# Altium schematic sheet Scan.SchDoc
size A4
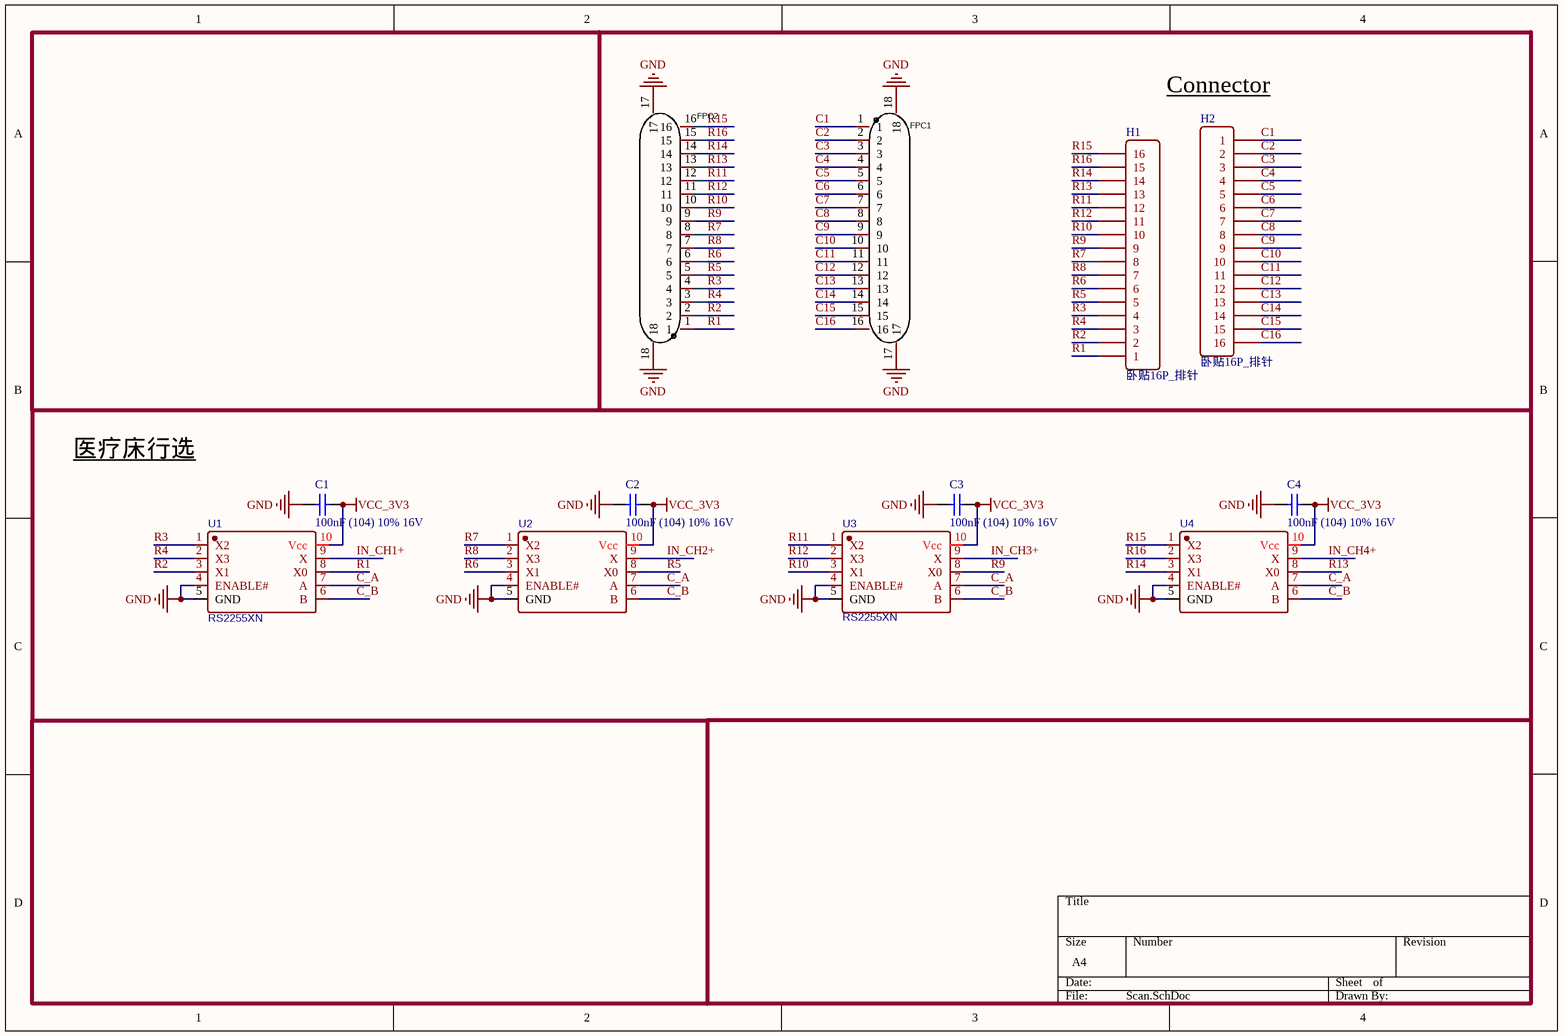
[diagram p0: Scan.SchDoc]

## Parts
C1  100nF (104) 10% 16V  [0402_C]
C2  100nF (104) 10% 16V  [0402_C]
C3  100nF (104) 10% 16V  [0402_C]
C4  100nF (104) 10% 16V  [0402_C]
FPC1  1.0K-FX-16PWB  [FPC-SMD_16P-P1.00-HDGC_1.0K-FX-16PWB]  (value not drawn)
FPC2  X10B25U16T  [FPC-SMD_X10B25U16T]  (value not drawn)
H1  卧贴16P_排针  [CONN-SMD_16PINS]
H2  卧贴16P_排针  [CONN-SMD_16PINS]
U1  RS2255XN  [MSOP-10_L3.0-W3.0-P0.50-LS5.0-BL]
U2  (no value)  [MSOP-10_L3.0-W3.0-P0.50-LS5.0-BL]
U3  RS2255XN  [MSOP-10_L3.0-W3.0-P0.50-LS5.0-BL]
U4  (no value)  [MSOP-10_L3.0-W3.0-P0.50-LS5.0-BL]

## Nets
GND: C1.2 C2.2 C3.2 C4.2 FPC1.17 FPC1.18 FPC2.17 FPC2.18 U1.4(ENABLE#) U1.5(GND) U2.4(ENABLE#) U2.5(GND) U3.4(ENABLE#) U3.5(GND) U4.4(ENABLE#) U4.5(GND)
VCC_3V3: C1.1 C2.1 C3.1 C4.1 U1.10(Vcc) U2.10(Vcc) U3.10(Vcc) U4.10(Vcc)
C1: FPC1.1 H2.1
C2: FPC1.2 H2.2
C3: FPC1.3 H2.3
C4: FPC1.4 H2.4
C5: FPC1.5 H2.5
C6: FPC1.6 H2.6
C7: FPC1.7 H2.7
C8: FPC1.8 H2.8
C9: FPC1.9 H2.9
C10: FPC1.10 H2.10
C11: FPC1.11 H2.11
C12: FPC1.12 H2.12
C13: FPC1.13 H2.13
C14: FPC1.14 H2.14
C15: FPC1.15 H2.15
C16: FPC1.16 H2.16
C_A: U1.7(A) U2.7(A) U3.7(A) U4.7(A)
C_B: U1.6(B) U2.6(B) U3.6(B) U4.6(B)
IN_CH1+: U1.9(X)
IN_CH2+: U2.9(X)
IN_CH3+: U3.9(X)
IN_CH4+: U4.9(X)
R1: FPC2.1 H1.1 U1.8(X0)
R2: FPC2.2 H1.2 U1.3(X1)
R3: FPC2.4 H1.4 U1.1(X2)
R4: FPC2.3 H1.3 U1.2(X3)
R5: FPC2.5 H1.5 U2.8(X0)
R6: FPC2.6 H1.6 U2.3(X1)
R7: FPC2.8 H1.8 U2.1(X2)
R8: FPC2.7 H1.7 U2.2(X3)
R9: FPC2.9 H1.9 U3.8(X0)
R10: FPC2.10 H1.10 U3.3(X1)
R11: FPC2.12 H1.12 U3.1(X2)
R12: FPC2.11 H1.11 U3.2(X3)
R13: FPC2.13 H1.13 U4.8(X0)
R14: FPC2.14 H1.14 U4.3(X1)
R15: FPC2.16 H1.16 U4.1(X2)
R16: FPC2.15 H1.15 U4.2(X3)

## Notes on the sheet
- (near H2) Connector
- 医疗床行选

## Library data of the parts
C1-C4 = 0402 100nF (104) 10% 16V: 贴片电容; ComponentLink1Description: 供应商链接; ComponentLink1URL: http://www.szlcsc.com/product/details_1877.html; Package: 0402; Supplier: LC; SuppliersPartNumber: C1525
FPC1 = FPC_16P_抽屉式下接: Manufacturer: HDGC(华德共创); Add into BOM: yes; Pitch: 1mm; Number of Contacts: 16; Locking Feature: 抽屉式; FFC, FCB Thickness: 0.3mm; Name: 1.0K-FX-16PWB; Symbol: 1.0K-FX-16PWB; Device: 1.0K-FX-16PWB; LCSC Part Name: 1mm P数:16 抽屉式 下接; Supplier Part: C2914075; Manufacturer Part: 1.0K-FX-16PWB; Supplier Footprint: SMD,P=1mm; JLCPCB Part Class: Extended Part; Datasheet: https://atta.szlcsc.com/upload/public/pdf/source/20211102/926C0C24B01018ECCB068402A8A27F57.pdf; Supplier: LCSC; Convert to PCB: yes; Mounting Type: 卧贴; Contact Type: 下接; Height Above Board: 2.5mm; Operating Temperature Range: -20℃~+85℃
FPC2 = FPC_16P_抽屉式上接: Manufacturer: XKB Connectivity(中国星坤); Add into BOM: yes; Pitch: 1mm; Number of Contacts: 16; Locking Feature: 抽屉式; FFC, FCB Thickness: 0.3mm; Welding Temperature (Max): 260℃; Name: X10B25U16T; Symbol: X10B25U16T; Device: X10B25U16T; LCSC Part Name: 1mm P数:16 抽屉式 上接 镀锡; Supplier Part: C500194; Manufacturer Part: X10B25U16T; Supplier Footprint: SMD,P=1mm; JLCPCB Part Class: Extended Part; Datasheet: https://atta.szlcsc.com/upload/public/pdf/source/20211011/E8BDE13A8FA62B089EE070F29D883999.pdf; Supplier: LCSC; Convert to PCB: yes; Mounting Type: 卧贴; Contact Type: 上接; Height Above Board: 2.5mm; Contact Material: 磷青铜; Contact Plating: 金; Operating Temperature Range: -40℃~+85℃
U1-U4 = RS2255XN: BOM_Manufacturer: Jiangsu RUNIC Tech; Contributor: LCSC; BOM_Supplier: LCSC; BOM_Supplier Part: C783421; BOM_Manufacturer Part: RS2255XN; BOM_JLCPCB Part Class: Extended Part; spicePre: U; spiceSymbolName: RS2255XN